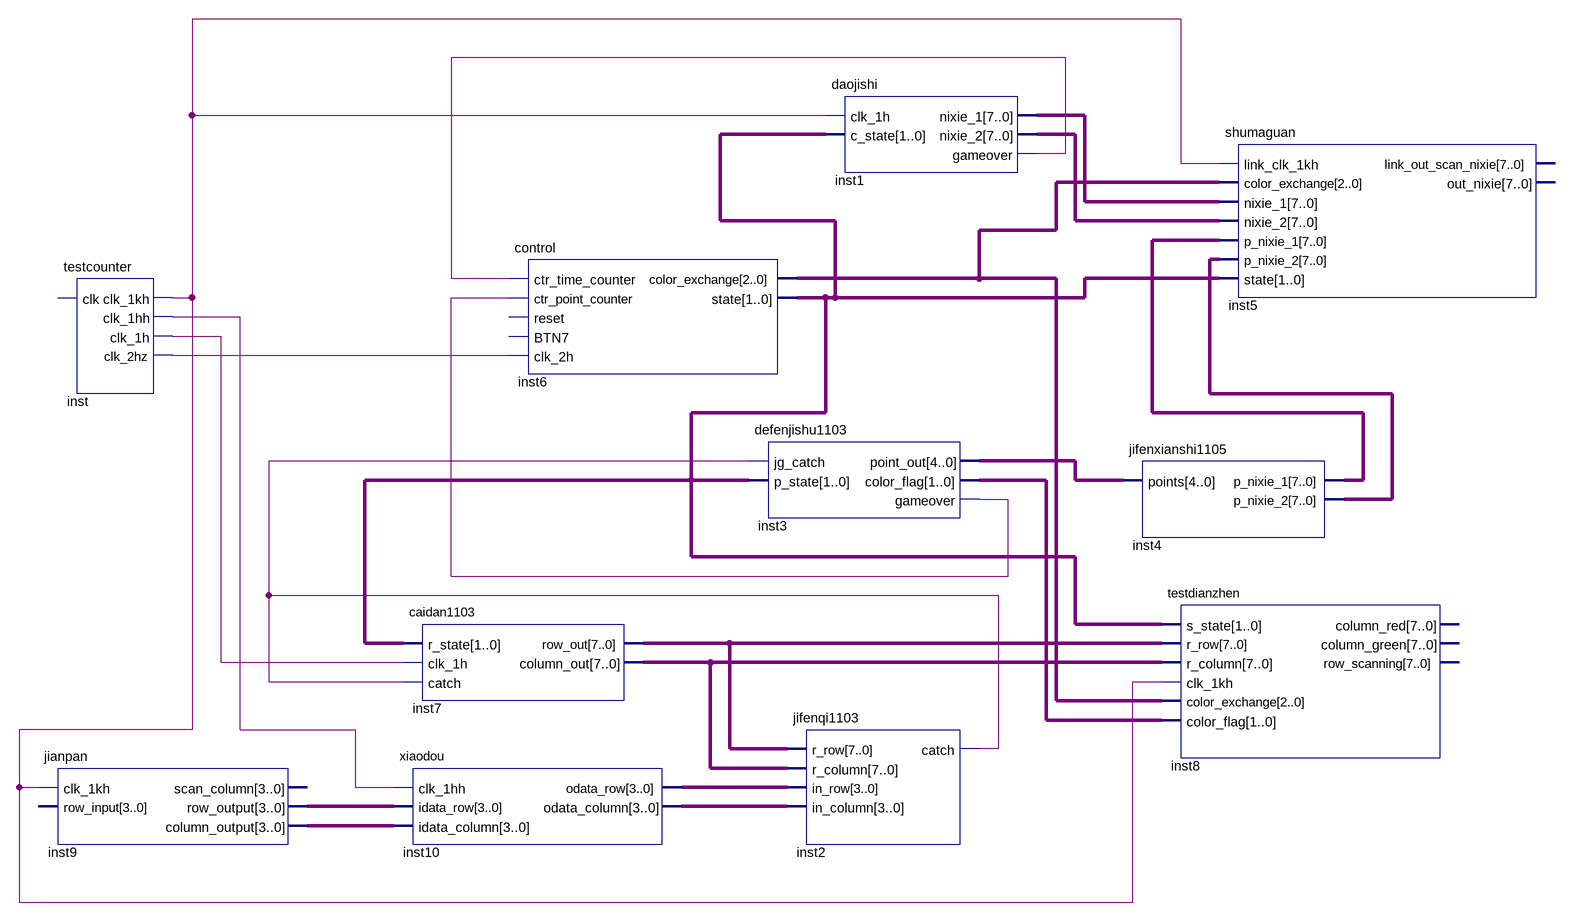
[diagram p0: schematic sheet]
// Quartus schematic Block1.bdf as structural Verilog: 11 symbols, 0 pins
module Block1 (
);

  wire inst1_gameover, inst2_catch, inst3_gameover, inst_clk_1h, inst_clk_1hh, inst_clk_1kh, inst_clk_2hz;
  wire [1:0] inst3_color_flag, inst6_state;
  wire [2:0] inst6_color_exchange;
  wire [3:0] inst9_column_output, inst9_row_output, inst10_odata_column, inst10_odata_row;
  wire [4:0] inst3_point_out;
  wire [7:0] inst1_nixie_1, inst1_nixie_2, inst4_p_nixie_1, inst4_p_nixie_2, inst7_column_out, inst7_row_out;

  jianpan inst9 (
    .clk_1kh(inst_clk_1kh), .row_output(inst9_row_output), .column_output(inst9_column_output));  // open: row_input, scan_column
  testcounter inst (
    .clk_1kh(inst_clk_1kh), .clk_1hh(inst_clk_1hh), .clk_1h(inst_clk_1h), .clk_2hz(inst_clk_2hz));  // open: clk
  caidan1103 inst7 (
    .r_state(inst6_state), .clk_1h(inst_clk_1h), .catch(inst2_catch), .row_out(inst7_row_out),
    .column_out(inst7_column_out));
  xiaodou inst10 (
    .clk_1hh(inst_clk_1hh), .idata_row(inst9_row_output), .idata_column(inst9_column_output),
    .odata_row(inst10_odata_row), .odata_column(inst10_odata_column));
  control inst6 (
    .ctr_time_counter(inst1_gameover), .ctr_point_counter(inst3_gameover), .clk_2h(inst_clk_2hz),
    .color_exchange(inst6_color_exchange), .state(inst6_state));  // open: reset, BTN7
  defenjishu1103 inst3 (
    .jg_catch(inst2_catch), .p_state(inst6_state), .point_out(inst3_point_out),
    .color_flag(inst3_color_flag), .gameover(inst3_gameover));
  jifenqi1103 inst2 (
    .r_row(inst7_row_out), .r_column(inst7_column_out), .in_row(inst10_odata_row),
    .in_column(inst10_odata_column), .catch(inst2_catch));
  daojishi inst1 (
    .clk_1h(inst_clk_1kh), .c_state(inst6_state), .nixie_1(inst1_nixie_1), .nixie_2(inst1_nixie_2),
    .gameover(inst1_gameover));
  jifenxianshi1105 inst4 (.points(inst3_point_out), .p_nixie_1(inst4_p_nixie_1), .p_nixie_2(inst4_p_nixie_2));
  testdianzhen inst8 (
    .s_state(inst6_state), .r_row(inst7_row_out), .r_column(inst7_column_out), .clk_1kh(inst_clk_1kh),
    .color_exchange(inst6_color_exchange), .color_flag(inst3_color_flag));  // open: column_red, column_green, row_scanning
  shumaguan inst5 (
    .link_clk_1kh(inst_clk_1kh), .color_exchange(inst6_color_exchange), .nixie_1(inst1_nixie_1),
    .nixie_2(inst1_nixie_2), .p_nixie_1(inst4_p_nixie_1), .p_nixie_2(inst4_p_nixie_2), .state(inst6_state));  // open: link_out_scan_nixie, out_nixie
endmodule
